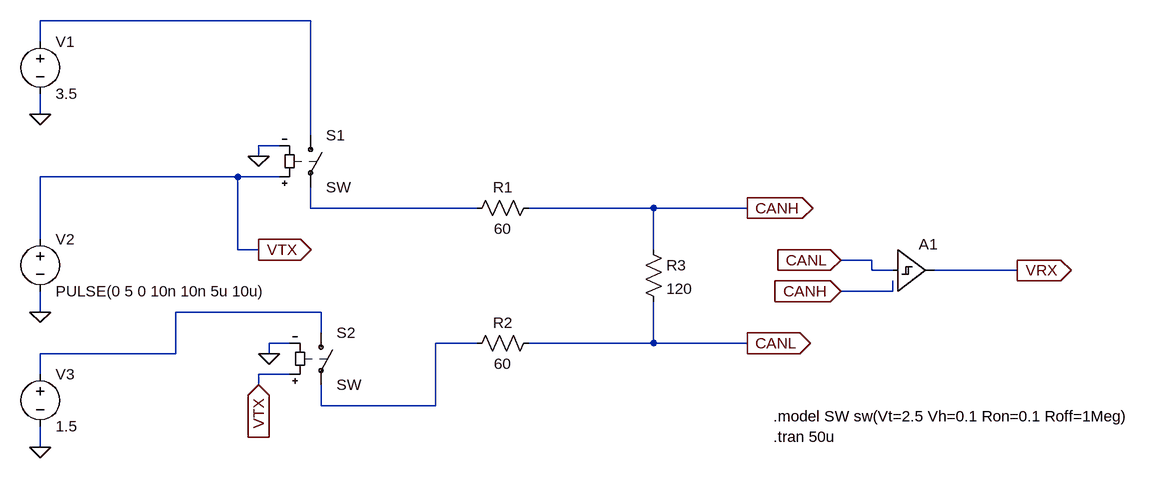
[diagram p0: schematic CAN_Transceiver.asc]
CAN_Transceiver.asc, the LTspice schematic file:
Version 4.1
SHEET 1 1648 740
WIRE 336 64 -80 64
WIRE -80 96 -80 64
WIRE -80 208 -80 176
WIRE 336 240 336 64
WIRE 288 256 256 256
WIRE 256 272 256 256
WIRE 224 304 -80 304
WIRE 288 304 224 304
WIRE 336 352 336 320
WIRE 592 352 336 352
WIRE 864 352 672 352
WIRE 1008 352 864 352
WIRE -80 400 -80 304
WIRE 224 416 224 304
WIRE 256 416 224 416
WIRE 864 416 864 352
WIRE 1200 432 1152 432
WIRE 1200 448 1200 432
WIRE 1232 448 1200 448
WIRE 1424 448 1296 448
WIRE 1232 480 1232 464
WIRE 1232 480 1152 480
WIRE -80 512 -80 480
WIRE 352 512 128 512
WIRE 352 544 352 512
WIRE 304 560 272 560
WIRE 592 560 528 560
WIRE 864 560 864 496
WIRE 864 560 672 560
WIRE 1008 560 864 560
WIRE 128 576 128 512
WIRE 128 576 -80 576
WIRE 272 576 272 560
WIRE -80 608 -80 576
WIRE 304 608 256 608
WIRE 256 624 256 608
WIRE 352 656 352 624
WIRE 528 656 528 560
WIRE 528 656 352 656
WIRE -80 720 -80 688
FLAG -80 512 0
FLAG -80 720 0
FLAG -80 208 0
FLAG 256 272 0
FLAG 272 576 0
FLAG 256 416 VTX
IOPIN 256 416 Out
FLAG 256 624 VTX
IOPIN 256 624 In
FLAG 1008 352 CANH
IOPIN 1008 352 Out
FLAG 1008 560 CANL
IOPIN 1008 560 Out
FLAG 1152 480 CANH
IOPIN 1152 480 In
FLAG 1152 432 CANL
IOPIN 1152 432 In
FLAG 1424 448 VRX
IOPIN 1424 448 Out
SYMBOL voltage -80 80 R0
WINDOW 123 0 0 Left 0
WINDOW 39 0 0 Left 0
SYMATTR InstName V1
SYMATTR Value 3.5
SYMBOL sw 336 224 R0
SYMATTR InstName S1
SYMBOL voltage -80 384 R0
WINDOW 123 0 0 Left 0
WINDOW 39 0 0 Left 0
SYMATTR InstName V2
SYMATTR Value PULSE(0 5 0 10n 10n 5u 10u)
SYMBOL voltage -80 592 R0
WINDOW 123 0 0 Left 0
WINDOW 39 0 0 Left 0
SYMATTR InstName V3
SYMATTR Value 1.5
SYMBOL sw 352 528 R0
SYMATTR InstName S2
SYMBOL res 688 336 R90
WINDOW 0 0 56 VBottom 2
WINDOW 3 32 56 VTop 2
SYMATTR InstName R1
SYMATTR Value 60
SYMBOL res 688 544 R90
WINDOW 0 0 56 VBottom 2
WINDOW 3 32 56 VTop 2
SYMATTR InstName R2
SYMATTR Value 60
SYMBOL res 848 400 R0
SYMATTR InstName R3
SYMATTR Value 120
SYMBOL Digital\\schmtbuf 1232 384 R0
SYMATTR InstName A1
TEXT 1048 672 Left 2 !.model SW sw(Vt=2.5 Vh=0.1 Ron=0.1 Roff=1Meg)
TEXT 1048 704 Left 2 !.tran 50u

The netlist it stands for:
* CAN_Transceiver.asc
V1 N001 0 3.5
S1 N001 N002 VTX 0 SW
V2 VTX 0 PULSE(0 5 0 10n 10n 5u 10u)
V3 N003 0 1.5
S2 N003 N004 VTX 0 SW
R1 CANH N002 60
R2 CANL N004 60
R3 CANH CANL 120
A1 CANL CANH CANH CANH CANH CANH VRX CANH SCHMITT
.model SW sw(Vt=2.5 Vh=0.1 Ron=0.1 Roff=1Meg)
.tran 50u
.backanno
.end